# EAGLE design ASD2421 (EAGLE 6.3)
DATABASE: ./../../../../../Components/TinyCircuits_Part_Database.txt
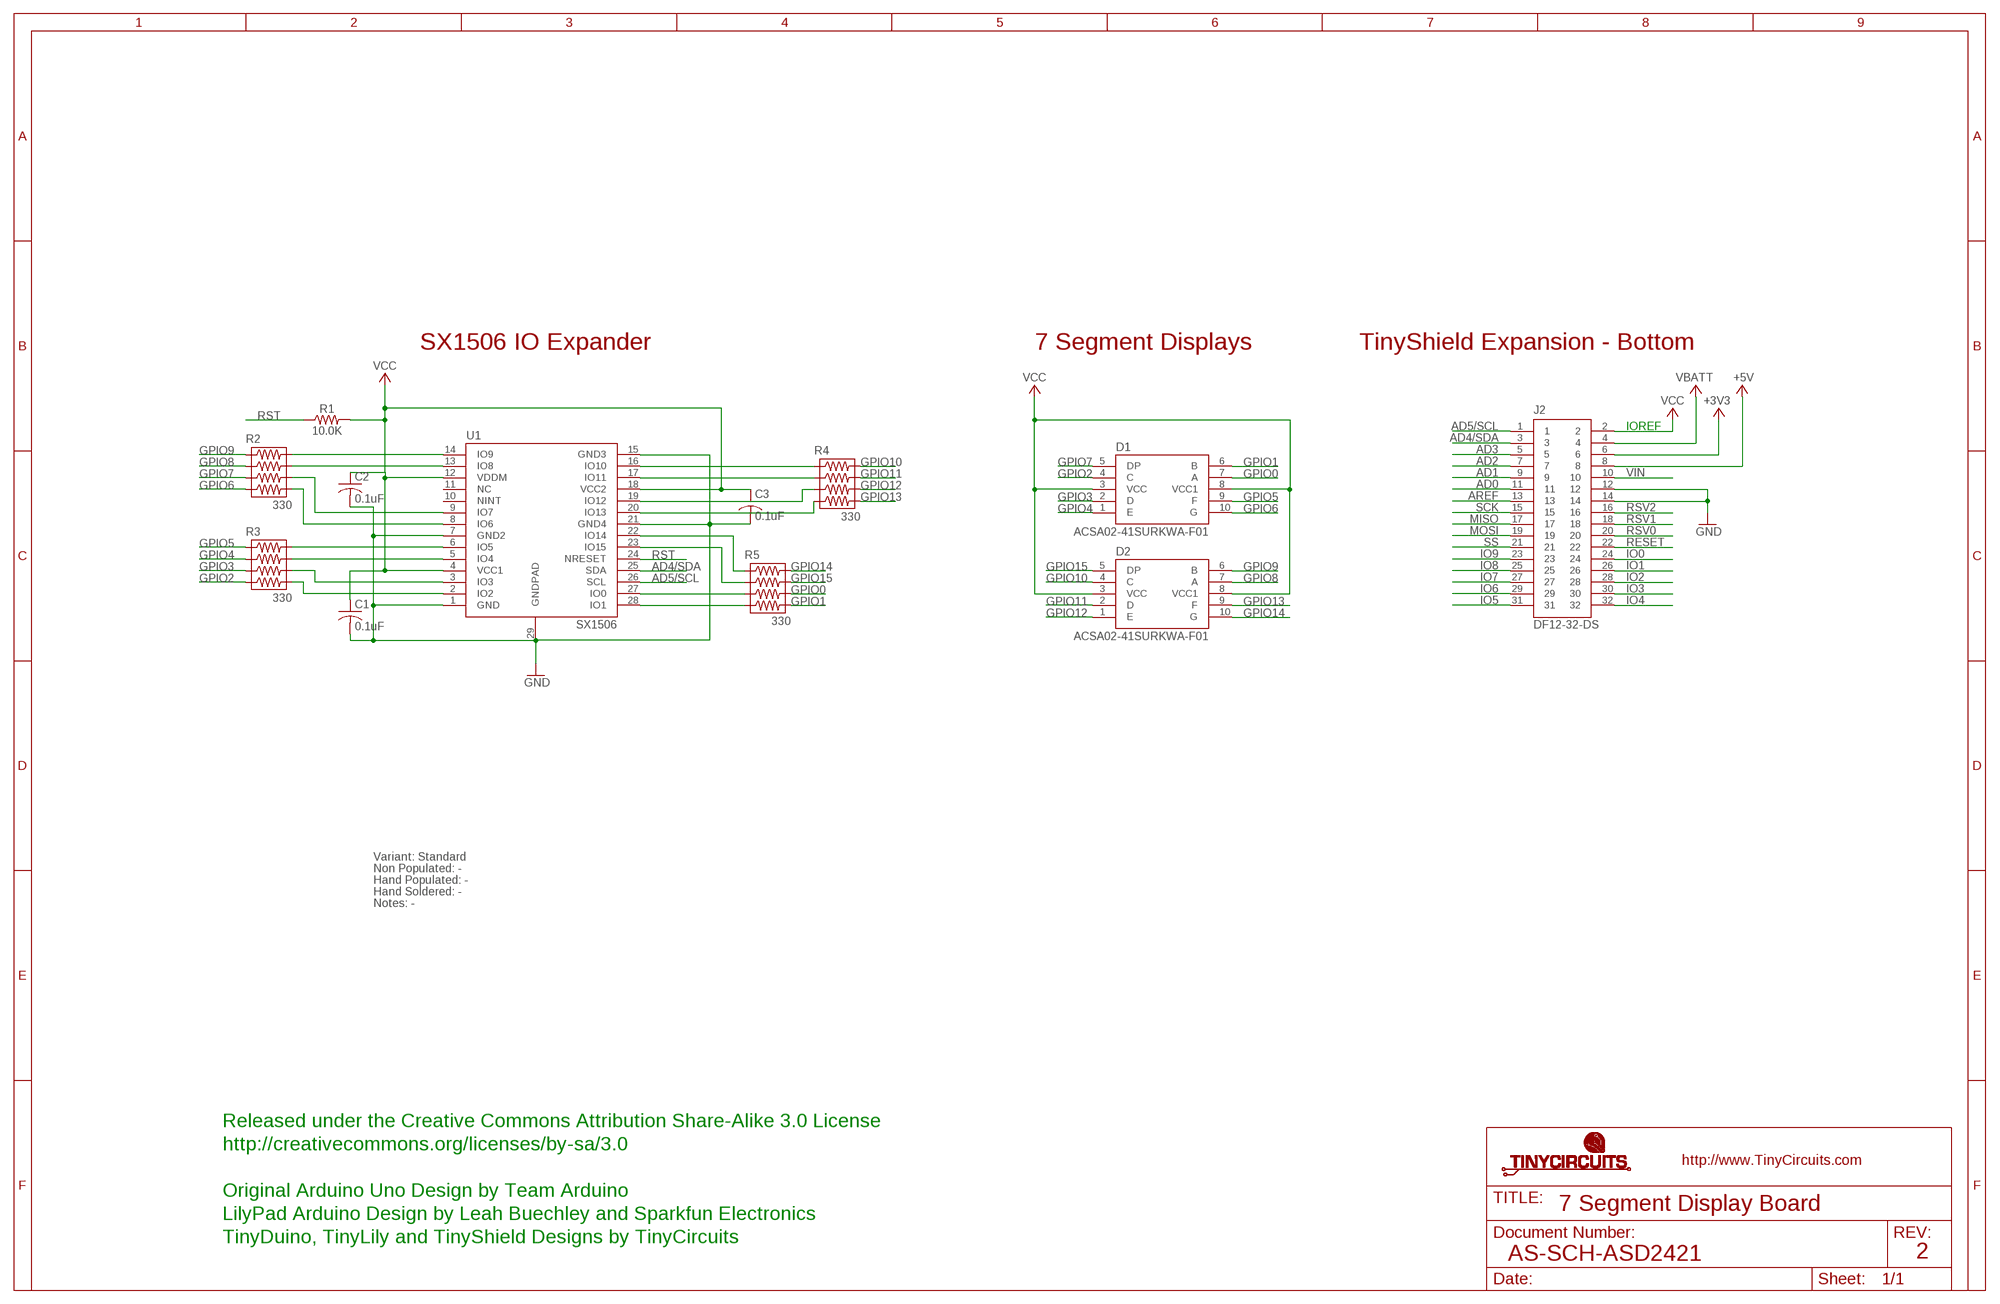
[diagram p0: schematic, sheet 1]

## Parts
C1  0.1uF  AS-ITM-00008  [C0402]
C2  0.1uF  AS-ITM-00008  [C0402]
C3  0.1uF  AS-ITM-00008  [C0402]
D1  ACSA02-41SURKWA-F01  AS-ITM-00133  [ACSA02-41SURKWA-F01]
D2  ACSA02-41SURKWA-F01  AS-ITM-00133  [ACSA02-41SURKWA-F01]
J2  DF12-32-DS  AS-ITM-00012  [DF12-32-DS]
R1  10.0K  AS-ITM-00032  [0402]
R2  330  AS-ITM-00135  [0402RPACK]
R3  330  AS-ITM-00135  [0402RPACK]
R4  330  AS-ITM-00135  [0402RPACK]
R5  330  AS-ITM-00135  [0402RPACK]
U1  SX1506  AS-ITM-00134  [SX1506]

## Nets
+3V3: J2.6
+5V: J2.8
AD0: J2.11
AD1: J2.9
AD2: J2.7
AD3: J2.5
AD4/SDA: J2.3 U1.25(SDA)
AD5/SCL: J2.1 U1.26(SCL)
AREF: J2.13
GND: C1.2 C2.2 C3.2 J2.12 J2.14 U1.1(GND) U1.7(GND2) U1.15(GND3) U1.21(GND4) U1.29(GNDPAD)
GPIO0: D1.7(A) R5.6
GPIO1: D1.6(B) R5.8
GPIO2: D1.4(C) R3.7
GPIO3: D1.2(D) R3.5
GPIO4: D1.1(E) R3.3
GPIO5: D1.9(F) R3.1
GPIO6: D1.10(G) R2.7
GPIO7: D1.5(DP) R2.5
GPIO8: D2.7(A) R2.3
GPIO9: D2.6(B) R2.1
GPIO10: D2.4(C) R4.2
GPIO11: D2.2(D) R4.4
GPIO12: D2.1(E) R4.6
GPIO13: D2.9(F) R4.8
GPIO14: D2.10(G) R5.2
GPIO15: D2.5(DP) R5.4
IO0: J2.24
IO1: J2.26
IO2: J2.28
IO3: J2.30
IO4: J2.32
IO5: J2.31
IO6: J2.29
IO7: J2.27
IO8: J2.25
IO9: J2.23
MISO: J2.17
MOSI: J2.19
N$1: R2.2 U1.14(IO9)
N$2: R2.4 U1.13(IO8)
N$3: R2.6 U1.9(IO7)
N$4: R2.8 U1.8(IO6)
N$6: R3.2 U1.6(IO5)
N$7: R3.4 U1.5(IO4)
N$9: R3.6 U1.3(IO3)
N$10: R3.8 U1.2(IO2)
N$19: R4.1 U1.16(IO10)
N$20: R4.3 U1.17(IO11)
N$21: R4.5 U1.19(IO12)
N$22: R4.7 U1.20(IO13)
N$23: R5.1 U1.22(IO14)
N$24: R5.3 U1.23(IO15)
N$25: R5.5 U1.27(IO0)
N$26: R5.7 U1.28(IO1)
RESET: J2.22
RST: R1.1 U1.24(NRESET)
RSV0: J2.20
RSV1: J2.18
RSV2: J2.16
SCK: J2.15
SS: J2.21
VBATT: J2.4
VCC: C1.1 C2.1 C3.1 D1.3(VCC) D1.8(VCC1) D2.3(VCC) D2.8(VCC1) J2.2 R1.2 U1.4(VCC1) U1.12(VDDM) U1.18(VCC2)
VIN: J2.10
Unconnected: U1.10(NINT) U1.11(NC)

## Notes on the sheet
- SX1506 IO Expander | 7 Segment Displays | TinyShield Expansion - Bottom
- IOREF
- Variant: Standard
- Non Populated: -
- Hand Populated: -
- Hand Soldered: -
- Notes: -
- Released under the Creative Commons Attribution Share-Alike 3.0 License
- http://creativecommons.org/licenses/by-sa/3.0
- Original Arduino Uno Design by Team Arduino
- 7 Segment Display Board
- LilyPad Arduino Design by Leah Buechley and Sparkfun Electronics
- TinyDuino, TinyLily and TinyShield Designs by TinyCircuits
- AS-SCH-ASD2421 | 2

## Library data of the parts
C1-C3 = tinycircuits:AS-ITM-00008: CAP CER 0.1UF 16V 10% X5R 0402; PARTNO: AS-ITM-00008
D1 D2 = tinycircuits:AS-ITM-00133: DISPLAY 0.2" SGL 630NM RED SMD; PARTNO: AS-ITM-00133; PNPROTATION: 270; VALUE: ACSA02-41SURKWA-F01
J2 = tinycircuits:AS-ITM-00012: CONN RECEPT 32POS 3MM SMD 0.5MM; PARTNO: AS-ITM-00012
R1 = tinycircuits:AS-ITM-00032: RES 10.0K OHM 1/16W 1% 0402 SMD; PARTNO: AS-ITM-00032
R2-R5 = tinycircuits:AS-ITM-00135: RES ARRAY 4 RES 330 OHM 0804; PARTNO: AS-ITM-00135
U1 = tinycircuits:AS-ITM-00134: IC GPIO EXP I2C 16CH 28UTQFN; PARTNO: AS-ITM-00134; PNPROTATION: 270

## Board
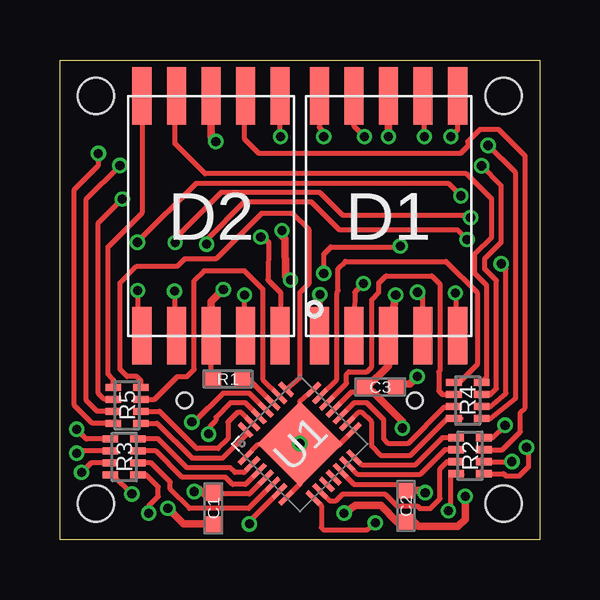
[diagram p1: board, top side]
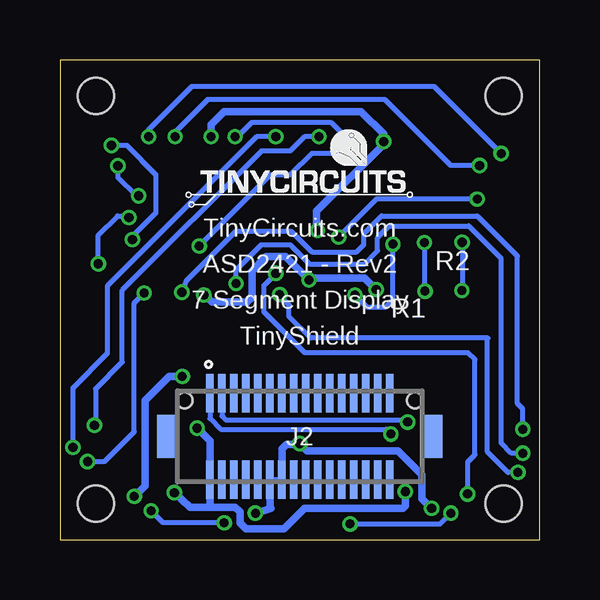
[diagram p2: board, bottom side, seen from below]

Size 20 x 20 mm. Coordinates in mm from the lower left corner, seen from the top.
Outline: 0,20 20,20 20,0 0,0 0,20
Copper layers (1*16): Top 0.035mm / dielectric 1.5mm / Bottom 0.035mm
Design rules "default *": minimum track width 8mil, minimum drill 12mil, track to track 7mil, track to pad 7mil, pad to pad 7mil, via to via 7mil, smd to smd 7mil, copper to edge 8mil, drill to drill 8mil, minimum pad ring 8mil, minimum via ring 5mil, stop-mask expansion 4mil, vias tented up to drill 25mil, thermal gap 10mil
Holes 1.5 mm at 1.5,18.5 18.5,18.5 18.5,1.5 1.5,1.5

### Footprints (pad centres in the part's own frame; a part is rotated, then mirrored left to right if it is on the bottom)
C0402 = smd 0.65 x 0.6: 1 -0.65,0; 2 0.65,0
ACSA02-41SURKWA-F01 = smd 0.8 x 2.4: 1 -2.88,-5; 2 -1.44,-5; 3 0,-5; 4 1.44,-5; 5 2.88,-5; 6 2.88,5; 7 1.44,5; 8 0,5; 9 -1.44,5; 10 -2.88,5
DF12-32-DS = smd 0.3 x 1.6: 1 -3.75,1.8; 2 -3.75,-1.8; 3 -3.25,1.8; 4 -3.25,-1.8; 5 -2.75,1.8; 6 -2.75,-1.8; 7 -2.25,1.8; 8 -2.25,-1.8; 9 -1.75,1.8; 10 -1.75,-1.8; 11 -1.25,1.8; 12 -1.25,-1.8; 13 -0.75,1.8; 14 -0.75,-1.8; 15 -0.25,1.8; 16 -0.25,-1.8; 17 0.25,1.8; 18 0.25,-1.8; 19 0.75,1.8; 20 0.75,-1.8; 21 1.25,1.8; 22 1.25,-1.8; 23 1.75,1.8; 24 1.75,-1.8; 25 2.25,1.8; 26 2.25,-1.8; 27 2.75,1.8; 28 2.75,-1.8; 29 3.25,1.8; 30 3.25,-1.8; 31 3.75,1.8; 32 3.75,-1.8 | smd 0.9 x 1.8: F1 -5.5,0; F2 5.5,0 | hole 0.65: -4.8,1.5; 4.8,1.5
0402 = smd 0.65 x 0.55: 1 -0.6,0; 2 0.6,0
0402RPACK = smd 0.3 x 0.65: 1 -0.75,0.575; 2 -0.75,-0.575; 3 -0.25,0.575; 4 -0.25,-0.575; 5 0.25,0.575; 6 0.25,-0.575; 7 0.75,0.575; 8 0.75,-0.575
SX1506 = smd 0.75 x 0.2: 1 -2,1.2; 2 -2,0.8; 3 -2,0.4; 4 -2,0; 5 -2,-0.4; 6 -2,-0.8; 7 -2,-1.2; 15 2,-1.2; 16 2,-0.8; 17 2,-0.4; 18 2,0; 19 2,0.4; 20 2,0.8; 21 2,1.2 | smd 0.2 x 0.75: 8 -1.2,-2; 9 -0.8,-2; 10 -0.4,-2; 11 0,-2; 12 0.4,-2; 13 0.8,-2; 14 1.2,-2; 22 1.2,2; 23 0.8,2; 24 0.4,2; 25 0,2; 26 -0.4,2; 27 -0.8,2; 28 -1.2,2 | smd 2.5 x 2.5: 29 0,-0.025

### Placement (x,y rotation side)
C1  6.4,1.3 270 top
C2  14.43,1.4 270 top
C3  13.35,6.36 0 top
D1  13.7,13.5 0 top
D2  6.3,13.5 0 top
J2  10,4.3 0 bottom
R1  7,6.7 180 top
R2  17.1,3.5 270 top
R3  2.68,3.45 90 top
R4  17,5.8 90 top
R5  2.8,5.6 270 top
U1  10,4 45 top
U$1  [DOCFIELD-TINYCIRCUITS-PCB]  33.91,-10 0 top  (outside the outline)

### Tracks (layer width: path | path; a pad name or v marks a point on that pad's centre or on a via)
AD4/SDA  (via drill 0.38)
  Top 0.203: U1.25 7.9,6.1 6.8,6.1 5.6,4.9 v5.5,4.9
  Bottom 0.203: J2.3 13.25,5.15 13.1,5 5.6,5 v5.5,4.9
AD5/SCL  (via drill 0.38)
  Top 0.203: U1.26 7.73,5.7 7.1,5.7 6.5,5.1 6.5,4.97 6.3,4.77 v6.2,4.4
  Bottom 0.203: J2.1 13.75,5.05 13.3,4.6 6.4,4.6 v6.2,4.4
GND  (via drill 0.38)
  Top 0.203: U1.29 v10,4 11.52,3.92 11.61,3.92 U1.15 | U1.1 8.26,3.97 U1.29 | U1.21 9.99,5.75 U1.29 | 9.9,3.91 U1.29 | C3.2 14.14,6.5 | U1.7 10.02,2.32 U1.29
  Top 0.305: v11.85,1.1 12.32,1.42 13.38,1.42 14.05,0.75 C2.2 14.75,0.75 14.95,0.55 16.6,0.55 16.9,0.85 v16.9,1.8 | C1.2 5.15,0.65 v4.5,1.3 | 14.14,6.5 14.6,6.5 v14.9,6.8
  Bottom 0.203: 11.2,1.3 11.25,1.35 | v10,4 | v10,4 U1.29
  Bottom 0.254: J2.12 J2.14
  Bottom 0.305: v11.85,1.1 11.2,1.3 | 11.25,1.35 J2.12 | v4.5,1.3 4.9,1.7 4.9,2.7 5.9,3.7 9.7,3.7 v10,4 | J2.14 10.75,3.77 10.55,3.97 U1.29 | v14.9,6.8 15.45,6.8 16.45,5.8 16.45,2.25 v16.9,1.8
GPIO0  (via drill 0.38)
  Top 0.203: R5.6 1.55,5.35 1.1,5.8 1.1,14.2 v2.5,15.6 | v15.2,16.8 15.2,18.44 D1.7
  Bottom 0.203: v2.5,15.6 3.7,15.6 6.45,18.35 13.85,18.35 15.1,17.1 15.1,16.9 v15.2,16.8
GPIO1  (via drill 0.38)
  Top 0.203: R5.8 1.35,4.85 0.6,5.6 0.6,14.6 1.6,15.6 v1.6,16.1 | D1.6 16.58,17.08 v16.3,16.8
  Bottom 0.203: v16.3,16.8 16.3,17.1 14.5,18.9 4.4,18.9 v1.6,16.1
GPIO2  (via drill 0.38)
  Top 0.203: v14.92,10.31 15.12,10.33 D1.4 | R3.7 1.1,4.2 v0.7,4.6
  Bottom 0.203: v14.92,10.31 14.72,10.81 12.66,12.86 10.36,12.86 9.5,12 7.63,12 7.33,12.3 7.33,12.76 6.59,13.5 2.6,13.5 0.92,11.82 0.92,5.67 0.7,5.46 v0.7,4.6
GPIO3  (via drill 0.38)
  Top 0.203: v12.66,10.68 12.3,10.32 D1.2 | R3.5 0.8,3.7 v0.7,3.6
  Bottom 0.203: v0.7,3.6 1.18,3.6 1.6,4.02 1.6,11.71 2.96,13.07 6.27,13.07 6.76,12.59 6.76,12.03 7.29,11.5 9.6,11.5 10.4,12.3 11.6,12.3 12.66,11.24 v12.66,10.68
GPIO4  (via drill 0.38)
  Top 0.203: v10.84,10.21 10.84,8.39 D1.1 | R3.3 1.3,3.2 v0.9,2.8
  Bottom 0.203: v10.84,10.21 10.44,9.79 10.44,9.29 9.56,8.4 2.15,8.4 2.17,8.39 2.17,3.65 1.32,2.8 v0.9,2.8
GPIO5  (via drill 0.38)
  Top 0.203: R3.1 2.2,2.7 v3,1.9 | D1.9 12.26,17.24 v12.7,16.8 | v11,11.1 11,11.9 11.3,12.2 14.15,12.2 v14.19,12.24
  Bottom 0.203: 14.19,12.26 v14.19,12.24 11.24,15.2 10.4,15.2 9.5,16.1 8.7,16.1 8.2,16.6 8.2,16.9 8.7,17.4 12,17.4 12.6,16.8 v12.7,16.8 | v3,1.9 3,3.23 2.7,3.54 2.7,7.5 2.98,7.79 9.79,7.79 11.5,9.5 11.5,10.6 v11,11.1
GPIO6  (via drill 0.38)
  Top 0.203: R2.7 18.5,2.75 18.6,2.65 19.15,2.65 19.55,3.05 19.55,3.69 v19.46,3.84 | D1.10 10.82,17.18 11,17 v11,16.8
  Bottom 0.203: v11,16.8 11.8,16.8 18.02,10.59 18.02,7.77 19.46,6.33 v19.46,3.84
GPIO7  (via drill 0.38)
  Top 0.203: v16.49,10.28 16.59,8.3 D1.5 | R2.5 v18.85,3.25
  Bottom 0.203: 16.64,10.23 v16.49,10.28 16.9,9.88 16.9,4.5 18.15,3.25 v18.85,3.25
GPIO8
  Top 0.203: R2.3 18.45,3.75 19.2,4.5 19.2,5.3 19.4,5.5 19.4,16 18.3,17.1 17.5,17.1 17,16.6 17,16.4 16.7,16.1 8.3,16.1 7.7,16.7 7.7,18.46 D2.7
GPIO9  (via drill 0.38)
  Top 0.203: R2.1 18.03,4.24 v18.56,4.77 | D2.6 9.15,18.27 9.15,16.85 v9.2,16.8
  Bottom 0.203: v9.2,16.8 9.8,16.8 10.4,16.2 11.6,16.2 17.4,10.4 17.4,7.4 18.51,6.29 18.51,4.82 v18.56,4.77
GPIO10  (via drill 0.38)
  Top 0.203: v16.98,12.51 16.59,12.91 11.65,12.91 10.49,14.07 7.69,14.07 6.11,12.5 v6.11,12.32 | R4.2 17.95,5.05 19,5.9 19,15.29 v17.85,16.44 | D2.4 7.7,8.54 v7.7,10.2
  Bottom 0.203: v17.85,16.44 17.22,16.44 16.01,15.23 16.01,13.61 17.01,12.61 v16.98,12.51 | v7.7,10.2 7.2,9.7 6.4,9.7 6.11,9.99 v6.11,12.32
GPIO11  (via drill 0.38)
  Top 0.203: v4.77,10.36 4.77,8.38 D2.2 | R4.4 17.95,5.55 18.6,6.1 18.6,11.3 v18.4,11.5 | v4.8,12.39 4.8,12.55 6.72,14.47 10.84,14.47 11.79,13.53 17.03,13.53 v17.13,13.43
  Bottom 0.203: v4.8,12.39 4.79,10.38 v4.77,10.36 | v18.4,11.5 18.4,12.7 17.6,13.5 17.15,13.5 v17.13,13.43
GPIO12  (via drill 0.38)
  Top 0.203: v3.23,12.4 5.69,14.86 16.19,14.86 v16.72,14.34 | v3.24,10.38 3.24,8.42 D2.1 | R4.6 17.95,6.05 18.2,6.3 18.2,10.8 17.7,11.3 17.7,11.7 18.4,12.4 18.4,14.77 v17.59,15.58
  Bottom 0.203: v17.59,15.58 17.59,15.1 16.82,14.34 v16.72,14.34 | v3.23,12.4 3.23,10.39 v3.24,10.38
GPIO13
  Top 0.203: D2.9 4.79,18.3 4.79,16.51 6.05,15.26 16.95,15.26 18,14.2 18,12.6 17.3,11.9 17.3,11.1 17.8,10.6 17.8,6.77 R4.8
GPIO14
  Top 0.203: R5.2 2.22,6.68 2,6.9 2,12.2 3.42,13.62 D2.10
GPIO15  (via drill 0.38)
  Top 0.203: R5.4 1.85,5.85 1.6,6.1 1.6,13.2 v2.6,14.2 | v8.38,12.62 8.48,12.62 8.7,12.4 8.68,10.82 9.2,10.3 9.2,8.52 D2.5
  Bottom 0.203: v2.6,14.2 6.8,14.2 v8.38,12.62
N$1
  Top 0.203: R2.2 15.94,4.24 14.8,3.1 12.6,3.1 U1.14
N$2
  Top 0.203: R2.4 16.04,3.74 15,2.7 12.43,2.7 U1.13
N$3
  Top 0.203: R2.6 16.14,3.24 15.85,2.95 15.85,1.7 15.45,1.3 15,1.3 14.9,1.4 14.05,1.4 13.55,1.9 11.8,1.9 11.52,1.62 11.25,1.62 U1.9
N$4  (via drill 0.38)
  Top 0.203: R2.8 16.77,2.71 16.41,2.76 16.3,2.7 16.3,1.35 v16.2,1.2 | U1.8 10.9,1.4 10.9,0.5 11,0.4 12.8,0.4 v13.15,0.7
  Bottom 0.203: v13.15,0.7 15.7,0.7 v16.2,1.2
N$6  (via drill 0.38)
  Top 0.203: 3.59,2.69 R3.2 3.6,2.7 4.1,2.2 4.1,1.8 3.7,1.4 v3.7,1.1 | U1.6 7.9,0.77 v7.9,0.65
  Bottom 0.203: v7.9,0.65 4.15,0.65 v3.7,1.1
N$7
  Top 0.203: U1.5 7.87,1.3 5.4,1.3 4.6,2.1 4.6,2.4 3.8,3.2 R3.4
N$9
  Top 0.203: U1.3 7.73,2.3 7.2,2.3 6.9,2.6 5.1,2.6 4,3.7 R3.6
N$10
  Top 0.203: U1.2 7.67,2.8 7.3,2.8 7.1,3 5.3,3 4.1,4.2 R3.8
N$19
  Top 0.203: R4.1 16.73,5.04 16.14,5.04 14.6,3.5 13.4,3.5 13,3.9 13,4.9 12.6,5.3 12.43,5.3 U1.16
N$20
  Top 0.203: R4.3 16.01,5.51 14.5,4 13.7,4 13.5,4.2 13.5,5 12.8,5.7 12.27,5.7 U1.17
N$21
  Top 0.203: 16.05,6.05 R4.5 15.95,6.05 15.8,6.2 15.8,7 15.85,7.05 15.85,10.65 15.5,11 13.6,11 13.3,10.7 13.3,10.3 13,10 13,7.2 12.8,7 12.05,7 11.95,6.9 11.95,6.52 U1.19
N$22
  Top 0.203: U1.20 11.55,6.68 11.55,10.25 11.6,10.4 11.6,11.3 11.9,11.6 16.1,11.6 17.4,10.3 17.4,7.3 16.65,6.55 R4.7
N$23
  Top 0.203: R5.1 3.38,6.62 3.2,6.8 2.8,6.8 2.5,7.1 2.5,10.7 3.2,11.4 4.9,11.4 5.2,11.7 6.5,11.7 8.4,13.6 9.7,13.6 10.4,12.9 10.4,10.7 10,10.3 10,6.76 U1.22
N$24
  Top 0.203: R5.3 3.95,5.85 4.9,6.8 5.3,6.8 5.6,7.1 5.6,10.8 6,11.2 7.7,11.2 8.45,10.45 8.45,6.68 U1.23
N$25
  Top 0.203: U1.27 7.57,5.3 7.4,5.3 7,4.9 7,4.2 6.6,3.8 5.7,3.8 4.15,5.35 R5.5
N$26
  Top 0.203: U1.28 7.77,4.37 6.8,3.4 5.5,3.4 4.05,4.85 R5.7
RST
  Top 0.203: U1.24 7.87,6.7 R1.1
VCC  (via drill 0.38)
  Top 0.203: v15.23,1.95 15.2,1.95 | U1.12 12.27,2.3 14.08,2.3 C2.1 | U1.18 12.15,6.15 12.75,6.15 | R1.2 6.3,6.8 D2.3 | U1.4 7.9,1.9 6.25,1.9 C1.1 | C3.1 12.7,6.2 | D1.3 13.7,7.31
  Top 0.305: v9.26,12.89 9.26,12.65 9.38,12.53 9.4,10.97 v9.62,10.82 | 15.2,1.95 15.05,2.05 14.68,2.05 C2.1 | v14.28,4.65 14.28,4.92 13.05,6.15 12.75,6.15 12.7,6.2 | v5.6,2 5.8,2.1 6,1.9 6.25,1.9 | D2.3 6.3,9.92 v6.81,10.43 | D2.8 6.3,16.8 v6.5,16.6 | D1.8 v13.7,16.8 | v14,10.2 D1.3 | 13.7,7.31 13.7,7.25 12.81,6.36 C3.1
  Bottom 0.203: v9.62,10.82 9.64,10.78 9.62,10.87 | v14.28,4.65 14.3,4.67 | v6.5,16.6 6.5,16.5 | 9.3,12.93 v9.26,12.89 | 9.8,11 v9.62,10.82 | 9.54,10.9 v9.62,10.82 | J2.2 13.75,2.35 13.8,2.3
  Bottom 0.305: 13.8,1.35 12.7,1.35 12.5,1.15 12.5,0.7 12.25,0.45 10.65,0.45 9.8,1.3 5.7,1.3 5.6,1.4 v5.6,2 | 13.8,1.35 14.57,1.35 v15.23,1.95 | v14.28,4.65 13.75,4.12 J2.2 13.75,1.4 13.8,1.35 | 6.5,16.5 9.3,13.7 9.3,12.93 | v13.7,16.8 13.7,17.3 13.15,17.85 7.45,17.85 6.5,16.9 v6.5,16.6 | v14,10.2 13.65,9.9 12.2,9.9 12,10.1 12,11.2 11.4,11.8 10.6,11.8 v9.62,10.82 | v6.81,10.43 7.13,10.73 7.3,10.9 9.54,10.9

### Text on the board
bPlace: TinyCircuits.com | ASD2421 - Rev2 | 7 Segment Display | TinyShield
bNames: R2 | R1
Document: FABRICATION DRAWING | NOTES: | 1. PRINTED CIRCUIT BOARD MADE FROM NEMA GRADE FR-4 EPOXY LAMINATE | WITH 1 OUNCE COPPER PLATING AND .024 THICKNESS. | 2. ALL DIMENSIONS ARE GIVEN IN INCHES. | 3. CIRCUIT PATHS ARE FOR REFERENCE ONLY. | 4. HOLE SIZES SHOWN ARE FINISHED DIAMETERS AFTER PLATING. | 5. BOARD PLATED USING REFLOW OR SIMILAR METHOD. | 6. BOARD TO HAVE BLUE SOLDER MASK ON PLATED SURFACES USING WET FILM | 7. SILKSCREEN BOARD USING WHITE INK. | SR100 OR SR1010 EPOXY. EQUIVALENT WET OR DRY FILM MAY BE USED. | 8. THE FOLLOWING INFORMATION APPLIES TO THIS BOARD: | * 2 COPPER LAYERS | * .024 BOARD THICKNESS | * REQUIRES TOP SIDE SILKSCREEN | Released under the Creative Commons Attribution Share-Alike 3.0 License | http://creativecommons.org/licenses/by-sa/3.0 | Original Arduino Uno Design by Team Arduino | LilyPad Arduino Design by Leah Buechley and Sparkfun Electronics | TinyDuino, TinyLily and TinyShield Designs by TinyCircuits | TinyShield - 7-Segment Display Board | AS-PCB-ASD2421 | 2